# EAGLE design brick_analog_touch (EAGLE 7.3.0)
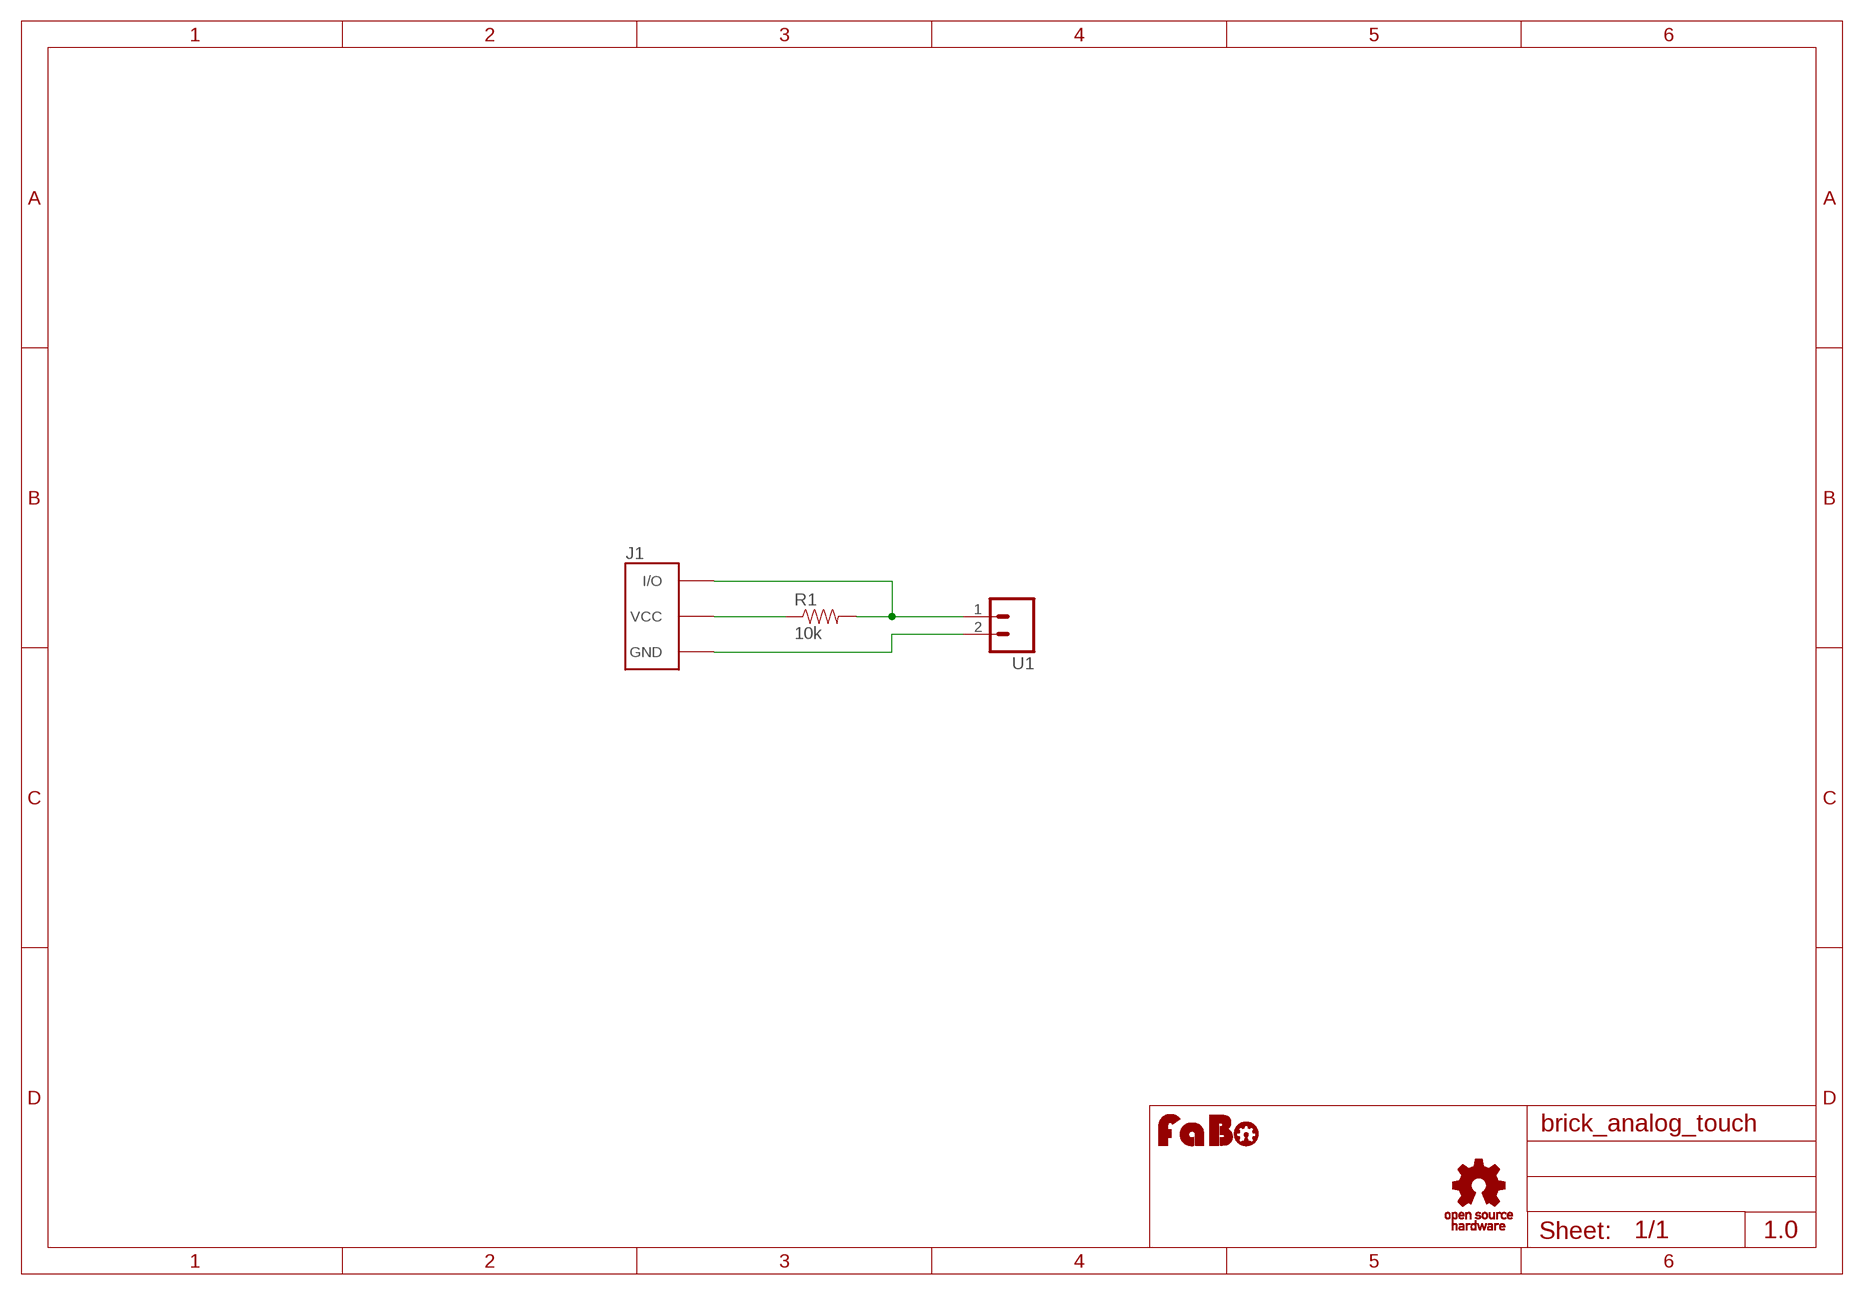
[diagram p0: schematic, sheet 1]

## Parts
J1  BRICK_3PIN_NORMAL  [BRICK_3PIN]
R1  10k  RES-PTH-REGULAR  [RES-AXL-REGULAR]
U1  M02LOCK  [1X02_LOCK]
U$2  LOGO_OSHW_T-M  [LOGO_OSHW_T_M]
U$3  LOGO_FABO-M  [LOGO_FABO_M]

## Nets
GND: J1.GND U1.2
N$1: J1.IN/OUT(I/O) R1.P$2 U1.1
N$2: J1.VCC R1.P$1

## Notes on the sheet
- 1.0

## Library data of the parts
J1 = Gclue:BRICK_3PIN: FaBo Brick 3pin
R1 = Gclue:RES
U1 = SparkFun:M02: Header 2 Standard 2-pin 0.1" header. Use with straight break away headers (SKU : PRT-00116), right angle break away headers (PRT-00553), swiss pins (PRT-00743), machine pins (PRT-00117), and female headers (PRT-00115). Molex polarized connector foot print use with SKU : PRT-08233 with associated crimp pins and housings.
U$2 = Gclue:LOGO_OSHW_T
U$3 = FaBo:LOGO_FABO

## Board
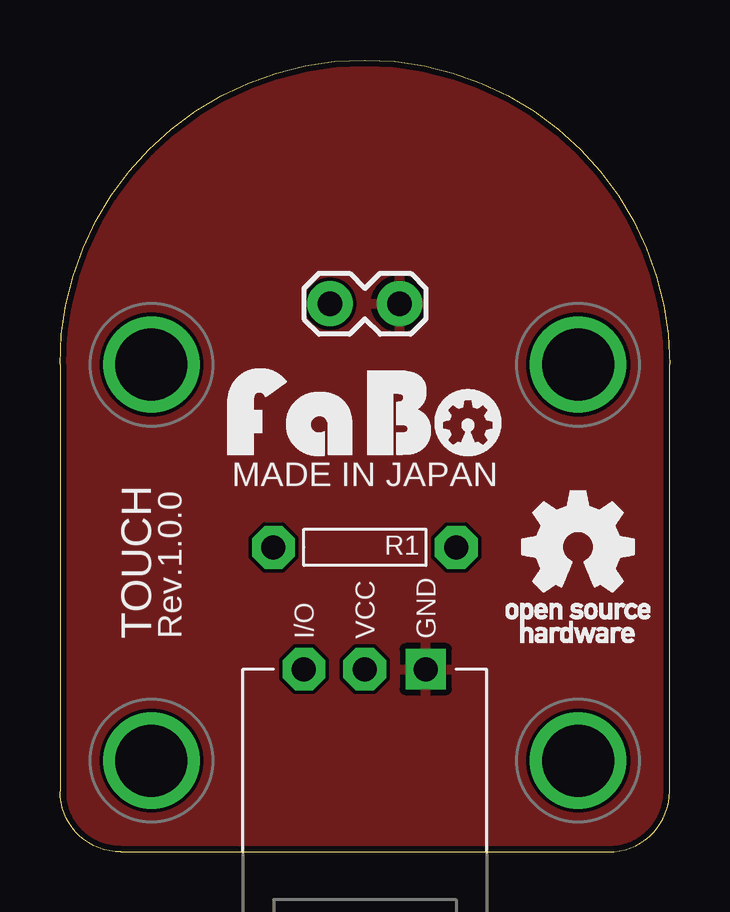
[diagram p1: board, top side]
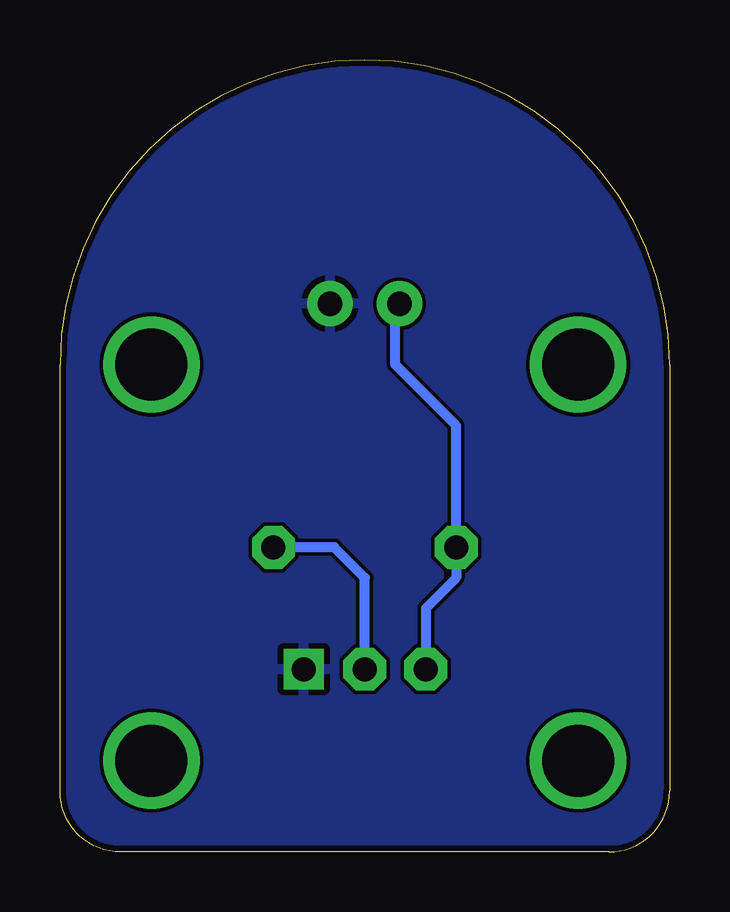
[diagram p2: board, bottom side, seen from below]

Size 25.4 x 33.02 mm. Coordinates in mm from the lower left corner, seen from the top.
Copper layers (1*16): Top 0.035mm / dielectric 1.5mm / Bottom 0.035mm
Design rules "Elecrow_2-layer_eagle_rule": minimum track width 6mil, minimum drill 12mil, track to track 6mil, track to pad 6mil, pad to pad 6mil, via to via 6mil, smd to smd 0mil, copper to edge 10mil, drill to drill 10mil, minimum pad ring 10mil, minimum via ring 6mil, stop-mask expansion 2mil, vias tented up to drill 100mil, thermal gap 10mil

### Footprints (pad centres in the part's own frame; a part is rotated, then mirrored left to right if it is on the bottom)
FABO_BRICK_3PIN = drill 1 pad 1.676 square: GND 2.54,-8.89 | drill 1 pad 1.778 octagon: IN/OUT -2.54,-8.89; VCC 0,-8.89 | drill 3 pad 3.81: P$5 -8.89,3.81; P$6 8.89,3.81; P$7 -8.89,-12.7; P$8 8.89,-12.7
RES-AXL-REGULAR = drill 1 pad 1.778 octagon: P$1 -3.81,0; P$2 3.81,0
1X02_LOCK = drill 1.016 pad 1.88: 1 -0.178,0; 2 2.718,0

### Placement (x,y rotation side)
J1  [FABO_BRICK_3PIN]  12.7,16.51 0 top
R1  12.7,12.7 180 top
U1  11.43,22.86 0 top
U$2  21.59,12.7 0 top
U$3  12.7,16.51 0 top

### Tracks (layer width: path | path; a pad name or v marks a point on that pad's centre or on a via)
GND
  pour Bottom: -1.27,-1.27 26.67,-1.27 26.67,34.29 -1.27,34.29
  pour Top: -1.27,-1.27 26.67,-1.27 26.67,34.29 -1.27,34.29
N$1
  Bottom 0.406: J1.IN/OUT 10.16,10.16 8.89,11.43 R1.P$2 8.89,17.78 11.43,20.32 11.43,22.68 U1.1
N$2
  Bottom 0.406: J1.VCC 12.7,11.43 13.97,12.7 R1.P$1

### Text on the board
tPlace: MADE IN JAPAN | TOUCH | Rev.1.0.0